# Altium project DC_Buck_Converter_5V.PrjPcb
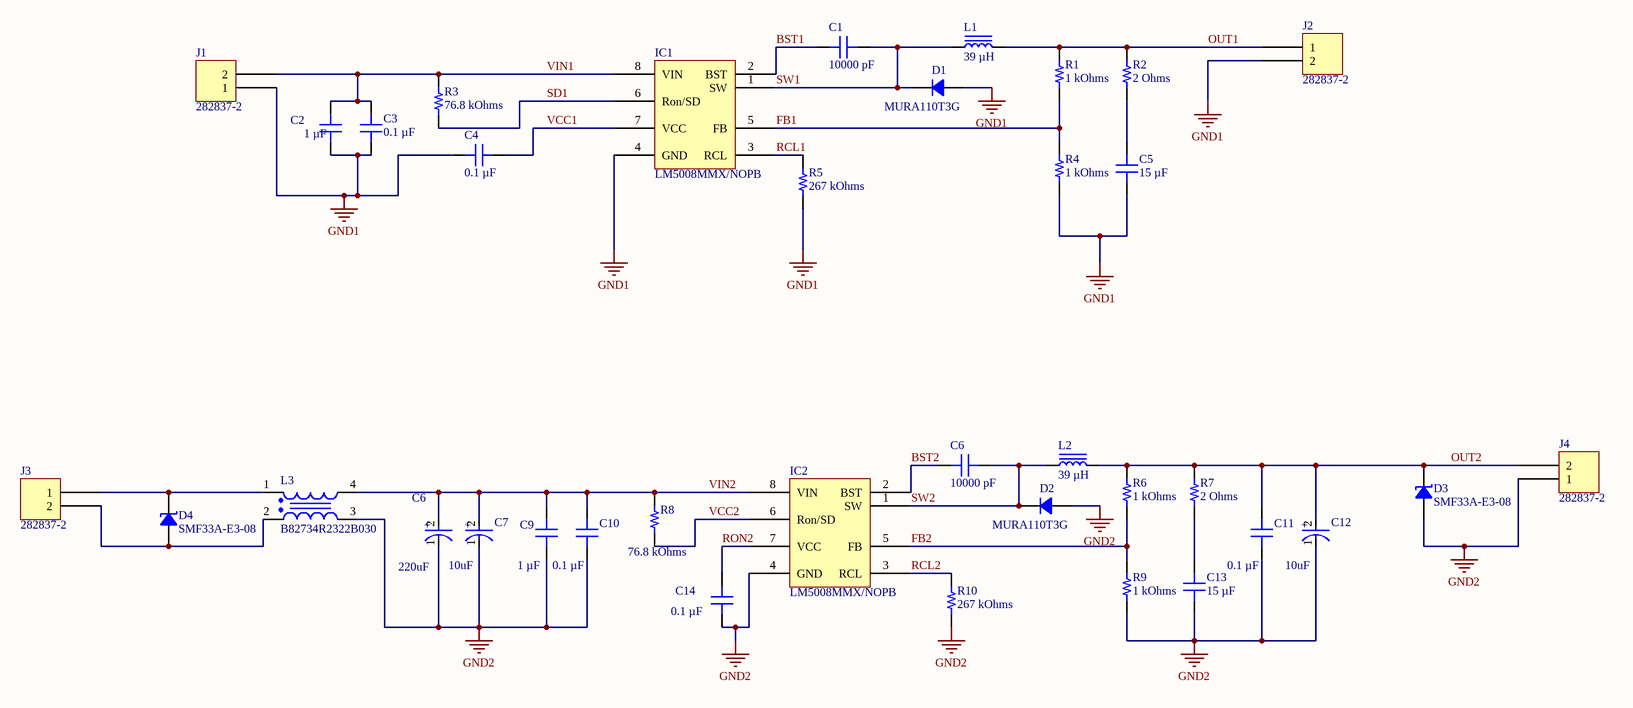
[diagram p0: Main.SchDoc]
1 sheet, 37 parts. Net scope: global (net labels, ports and power ports of the same name join across sheets).
Board file: DC_Buck_5V.PcbDoc

## Sheet Main.SchDoc
size A3; SheetNumber: 1; SheetTotal: 1

### Parts
(Parts that share a designator on the sheet are numbered #1, #2 ... from top to bottom, then left to right.)
C1  10000 pF  [CAP 0603_1608]
C2  1 µF  [CAP 0603_1608]
C3  0.1 µF  [CAP 0603_1608]
C4  0.1 µF  [CAP 0603_1608]
C5  15 µF  [CAP 0603_1608]
C6#1  10000 pF  [CAP 0603_1608]
C6#2  Capacitance: 220uF  [FP-FC-G-MFG]  (hidden comment: EEE-FC1H221P)
C7  Capacitance: 10uF  [FP-UUT1H100MCL1GS-MFG]  (hidden comment: UUT1H100MCL1GS)
C9  1 µF  [CAP 0603_1608]
C10  0.1 µF  [CAP 0603_1608]
C11  0.1 µF  [CAP 0603_1608]
C12  Capacitance: 10uF  [FP-UUT1H100MCL1GS-MFG]  (hidden comment: UUT1H100MCL1GS)
C13  15 µF  [CAP 0603_1608]
C14  0.1 µF  [CAP 0603_1608]
D1  MURA110T3G  [DO214AC SMA]
D2  MURA110T3G  [DO214AC SMA]
D3  SMF33A-E3-08  [SMF DO-219AB]
D4  SMF33A-E3-08  [SMF DO-219AB]
IC1  LM5008MMX/NOPB  [TI VSSOP-8 DGK]
IC2  LM5008MMX/NOPB  [TI VSSOP-8 DGK]
J1  282837-2  [TE 282837-2]
J2  282837-2  [TE 282837-2]
J3  282837-2  [TE 282837-2]
J4  282837-2  [TE 282837-2]
L1  39 µH  [BOURNS SRR1280]
L2  39 µH  [BOURNS SRR1280]
L3  Part Number: B82734R2322B030  [B82732R2112B30]  (hidden comment: Choke Alt)
R1  1 kOhms  [RES 0603_1608]
R2  2 Ohms  [RES 0603_1608]
R3  76.8 kOhms  [RES 0603_1608]
R4  1 kOhms  [RES 0603_1608]
R5  267 kOhms  [RES 0603_1608]
R6  1 kOhms  [RES 0603_1608]
R7  2 Ohms  [RES 0603_1608]
R8  76.8 kOhms  [RES 0603_1608]
R9  1 kOhms  [RES 0603_1608]
R10  267 kOhms  [RES 0603_1608]

### Nets
GND1: C2.1 C3.1 C4.2 C5.1 D1.1 IC1.4(GND) J1.1 J2.2 R4.1 R5.1
GND2: C6#2.1(C) C7.1(C) C9.1 C10.1 C11.1 C12.1(C) C13.1 C14.2 D2.1 D3.1 IC2.4(GND) J4.1 L3.3 R9.1 R10.1
BST1: C1.1 IC1.2(BST)
BST2: C6#1.1 IC2.2(BST)
FB1: IC1.5(FB) R1.1 R4.2
FB2: IC2.5(FB) R6.1 R9.2
OUT1: J2.1 L1.2 R1.2 R2.2
OUT2: C11.2 C12.2(A) D3.2 J4.2 L2.2 R6.2 R7.2
RCL1: IC1.3(RCL) R5.2
RCL2: IC2.3(RCL) R10.2
RON2: C14.1 IC2.7(VCC)
SD1: IC1.6(Ron/SD) R3.1
SW1: C1.2 D1.2 IC1.1(SW) L1.1
SW2: C6#1.2 D2.2 IC2.1(SW) L2.1
VCC1: C4.1 IC1.7(VCC)
VCC2: IC2.6(Ron/SD) R8.1
VIN1: C2.2 C3.2 IC1.8(VIN) J1.2 R3.2
VIN2: C6#2.2(A) C7.2(A) C9.2 C10.2 IC2.8(VIN) L3.4 R8.2
NetC5_2: C5.2 R2.1
NetC13_2: C13.2 R7.1
NetD4_1: D4.1 J3.2 L3.2
NetD4_2: D4.2 J3.1 L3.1

### Notes on the sheet
- TITLE:
- AUTHOR :
- DOCUMENT NAME:
- PART NO.:
- TEMPLATE:
- A3
- REVIEWER:
- This document is created by Mitai. Any further questions can be asked through
- Sheet
- of
- DATE:
- team@mitai.ai.
- Contact Address:Rosenheimer Straße 116b,81669, München.
- (in symbol CMP-05427-002161-1) +
- (in symbol CMP-12462-000014-1) +

### Library data of the parts
C1 C6#1 = AC0603KRX7R0BB103: CAP CER 10000PF 100V X7R 0603; manufacturer: Yageo; Tolerance: ±10%; Part Number: AC0603KRX7R0BB103; Value: 10000 pF; Applications: Automotive; Capacitance: 10000 pF; componentlink1description: Datasheet; componentlink1url: http://www.yageo.com/NewPortal/_en/search/productDocs.jsp?YageoPartNumber=AC0603KRX7R0BB103; componentlink2description: DigiKey Link; componentlink2url: https://www.digikey.com/en/products/detail/yageo/AC0603KRX7R0BB103/6643086; Device Package: 0603 (1608 Metric); lastupdated: 01/10/2023 19:09:12; Lifecycle Status: Active; Minimum Order: 1; Mounting Type: Surface Mount, MLCC; Operating Temperature: -55°C ~ 125°C; Package / Case: 0603 (1608 Metric); packaging: TapeAndReel; partid: 2218; Part Status: Active; price: 0.01; Ratings: AEC-Q200; series: AC; Size / Dimension: 0.063" L x 0.031" W (1.60mm x 0.80mm); Supplier 1: DigiKey; Supplier Part Number 1: 311-3100-1-ND; Temperature Coefficient: X7R; Thickness (Max): 0.035" (0.90mm); Voltage - Rated: 100V
C2 C9 = UMK107ABJ105MAHT: CAP CER 1UF 50V X5R 0603; manufacturer: Taiyo Yuden; Tolerance: ±20%; Part Number: UMK107ABJ105MAHT; Value: 1 µF; Applications: Automotive, SMPS Filtering; Capacitance: 1 µF; componentlink1description: Datasheet; componentlink1url: https://www.yuden.co.jp/productdata/catalog/mlcc_all_hq_e.pdf; componentlink2description: DigiKey Link; componentlink2url: https://www.digikey.com/en/products/detail/taiyo-yuden/UMK107ABJ105MAHT/6563551; Device Package: 0603 (1608 Metric); lastupdated: 01/10/2023 19:09:10; Lifecycle Status: Active; Minimum Order: 1; Mounting Type: Surface Mount, MLCC; Operating Temperature: -55°C ~ 85°C; Package / Case: 0603 (1608 Metric); packaging: TapeAndReel; partid: 3194; Part Status: Active; price: 0.03; Ratings: AEC-Q200; series: M; Size / Dimension: 0.063" L x 0.031" W (1.60mm x 0.80mm); Supplier 1: DigiKey; Supplier Part Number 1: 587-4958-1-ND; Temperature Coefficient: X5R; Thickness (Max): 0.037" (0.95mm); Voltage - Rated: 50V
C3 C4 C10 C11 C14 = C0603C104K5RAC7411: CAP CER 0.1UF 50V X7R 0603; manufacturer: KEMET; Tolerance: ±10%; Part Number: C0603C104K5RAC7411; Value: 0.1 µF; Applications: Bypass, Decoupling; Capacitance: 0.1 µF; componentlink1description: Datasheet; componentlink1url: https://api.kemet.com/component-edge/download/datasheet/C0603C104K5RAC7411.pdf; componentlink2description: DigiKey Link; componentlink2url: https://www.digikey.com/en/products/detail/kemet/C0603C104K5RAC7411/3317013; Device Package: 0603 (1608 Metric); lastupdated: 01/10/2023 19:09:12; Lifecycle Status: Active; Minimum Order: 1; Mounting Type: Surface Mount, MLCC; Operating Temperature: -55°C ~ 125°C; Package / Case: 0603 (1608 Metric); packaging: TapeAndReel; partid: 2233; Part Status: Active; price: 0.01; series: SMD Comm X7R; Size / Dimension: 0.063" L x 0.031" W (1.60mm x 0.80mm); Supplier 1: DigiKey; Supplier Part Number 1: 399-C0603C104K5RAC7411CT-ND; Temperature Coefficient: X7R; Thickness (Max): 0.035" (0.90mm); Voltage - Rated: 50V
C5 C13 = C1608X5R0J156M080AC: CAP CER 15UF 6.3V X5R 0603; manufacturer: TDK Corporation; Tolerance: ±20%; Part Number: C1608X5R0J156M080AC; Value: 15 µF; Applications: General Purpose; Capacitance: 15 µF; componentlink1description: Datasheet; componentlink1url: https://product.tdk.com/info/en/catalog/datasheets/mlcc_commercial_general_en.pdf?ref_disty=digikey; componentlink2description: DigiKey Link; componentlink2url: https://www.digikey.com/en/products/detail/tdk-corporation/C1608X5R0J156M080AC/2792253; Device Package: 0603 (1608 Metric); Features: Low ESL; lastupdated: 01/10/2023 19:09:11; Lifecycle Status: Active; Minimum Order: 1; Mounting Type: Surface Mount, MLCC; Operating Temperature: -55°C ~ 85°C; Package / Case: 0603 (1608 Metric); packaging: TapeAndReel; partid: 2610; Part Status: Active; price: 0.07; series: C; Size / Dimension: 0.063" L x 0.031" W (1.60mm x 0.80mm); Supplier 1: DigiKey; Supplier Part Number 1: 445-8027-1-ND; Temperature Coefficient: X5R; Thickness (Max): 0.039" (1.00mm); Voltage - Rated: 6.3V
C6#2 = CMP-05427-002161-1: CAP ALUM 220UF 20% 50V SMD; Life (Hours): 1000Hour; Leakage Current: 3uA; Ripple Current (AC): 500mA; Material: Aluminium; ESR (Equivalent Series Resistance): 300mR; Package Quantity: 500; Series: FC; Construction: Cylindrical; Length: 10.5mm; Height: 10.2mm; Width: 900um; Height - Seated (Max): 0.402inch; Lead Free: Lead Free; Voltage Rating: 50V; Contact Plating: Tin; RoHS Compliant: Yes; Packaging: Tape and Reel; Radiation Hardening: No; Reach SVHC Compliant: Yes; Voltage: 50V; Tolerance: 20%; Mount: Surface Mount; Ratings: AEC-Q200; Min Operating Temperature: -40°C; Ripple Current: 500mA; Diameter: 10mm; Termination: SMD/SMT; Case/Package: Radial; Max Operating Temperature: 105°C; Impedance: 300mR; Voltage Rating (DC): 50V
C7 C12 = CMP-12462-000014-1: CAP ALUM 10UF 20% 50V SMD; Lead Diameter: 0.8mm; Dissipation Factor: 0.12%; Ripple Current: 30mA; Dielectric Material: Aluminium; Leakage Current: 3uA; Life (Hours): 2000Hour; Height: 5.8mm; Lead Free: Lead Free; Mount: Surface Mount; Diameter: 6.3mm; Voltage Rating: 50V; Packaging: Tape and Reel; Case/Package: SMD/SMT; REACH SVHC: No SVHC; Height - Seated (Max): 0.24inch; Lead Pitch: 2.2mm; Voltage Rating (DC): 50V; Voltage: 50V; Radiation Hardening: No; Package Quantity: 1; Length: 5.8mm; Ripple Current (AC): 30mA; Number of Pins: 2; Width: 6.6mm; Features: General Purpose; Termination: SMD/SMT; Tolerance: 20%; Max Operating Temperature: 105°C; Min Operating Temperature: -55°C
D1 D2 = MURA110T3G: DIODE GEN PURP 100V 2A SMA; Manufacturer: ON Semiconductor; Current - Reverse Leakage @ Vr: 2µA @ 100V; Diode Type: Standard; Reverse Recovery Time (trr): 30ns; Speed: Fast Recovery =< 500ns, > 200mA (Io); Voltage - Forward (Vf) (Max) @ If: 875mV @ 1A; Part Number: MURA110T3G; ComponentLink1Description: Datasheet; ComponentLink1URL: //media.digikey.com/pdf/Data%20Sheets/ON%20Semiconductor%20PDFs/MURA105T3-D.pdf; ComponentLink2Description: DigiKey Link; ComponentLink2URL: http://digikey.com/product-detail/en/on-semiconductor/MURA110T3G/MURA110T3GOSCT-ND/964568; Current - Average Rectified (Io): 2A; LastUpdated: 01/10/2023 20:19:19; Lifecycle Status: Active; Minimum Order: 1; Mounting Type: Surface Mount; Operating Temperature - Junction: -65°C ~ 175°C; Package / Case: DO-214AC, SMA; Packaging: TapeAndReel; PartId: 641; Part Status: Active; Price: 0.10; Series: -; Supplier 1: DigiKey; Supplier Part Number 1: MURA110T3GOSCT-ND; Supplier Device Package: SMA; Voltage - DC Reverse (Vr) (Max): 100V
D3 D4 = SMF33A-E3-08: TVS DIODE 33V 53.3V SMF; Manufacturer: Vishay Semiconductor Diodes Division; Capacitance @ Frequency: 198pF @ 1MHz; Current - Peak Pulse (10/1000µs): 3.8A; Power Line Protection: No; Power - Peak Pulse: 200W; Type: Zener; Unidirectional Channels: 1; Voltage - Breakdown (Min): 36.7V; Part Number: SMF33A-E3-08; Applications: General Purpose; ComponentLink1Description: Datasheet; ComponentLink1URL: http://www.vishay.com/docs/85881/smf5v0atosmf58a.pdf; ComponentLink2Description: DigiKey Link; ComponentLink2URL: http://digikey.com/product-detail/en/vishay-semiconductor-diodes-division/SMF33A-E3-08/SMF33A-E3-08CT-ND/1680634; LastUpdated: 29/10/2023 20:46:48; Lifecycle Status: Active; Minimum Order: 1; Mounting Type: Surface Mount; Operating Temperature: -65°C ~ 175°C (TJ); Package / Case: DO-219AB; Packaging: TapeAndReel; PartId: 5501; Part Status: Active; Price: 0.10; Series: -; Supplier 1: DigiKey; Supplier Part Number 1: SMF33A-E3-08CT-ND; Supplier Device Package: SMF; Voltage - Clamping (Max) @ Ipp: 53.3V; Voltage - Reverse Standoff (Typ): 33V
IC1 IC2 = LM5008MMX/NOPB: IC REG BUCK ADJ 350MA 8VSSOP; Manufacturer: Texas Instruments; Frequency - Switching: 50kHz ~ 600kHz; Function: Step-Down; Number of Outputs: 1; Output Configuration: Positive; Output Type: Adjustable; Synchronous Rectifier: No; Voltage - Input (Max): 95V; Voltage - Input (Min): 9.5V; Voltage - Output (Max): 75V; Voltage - Output (Min/Fixed): 2.5V; Part Number: LM5008MMX/NOPB; ComponentLink1Description: Datasheet; ComponentLink1URL: http://www.ti.com/general/docs/suppproductinfo.tsp?distId=10&gotoUrl=http%3A%2F%2Fwww.ti.com%2Flit%2Fgpn%2Flm5008; ComponentLink2Description: DigiKey Link; ComponentLink2URL: //digikey.com/product-detail/en/texas-instruments/LM5008MMX-NOPB/296-35288-2-ND/1871803; Current - Output: 350mA; Device Package: 8-TSSOP, 8-MSOP (0.118", 3.00mm Width); LastUpdated: 12/12/2019 10:27:36; Lifecycle Status: 0; Minimum Order: 1; Mounting Type: Surface Mount; Operating Temperature: -40°C ~ 125°C (TJ); Package / Case: 8-TSSOP, 8-MSOP (0.118", 3.00mm Width); Packaging: TapeAndReel; Part Status: Active; Price: 1.30; Series: -; Supplier 1: DigiKey; Supplier Part Number 1: 296-35288-2-ND; Supplier Device Package: 8-VSSOP; Topology: Buck
J1-J4 = 282837-2: TERM BLK 2P SIDE ENT 5.08MM PCB; Manufacturer: TE Connectivity AMP Connectors; Current: 13.5 A; Mating Orientation: Horizontal with Board; Number of Levels: 1; Pitch: 0.200" (5.08mm); Positions Per Level: 2; Voltage: 300 V; Wire Gauge: 16-28 AWG; Wire Termination: Screw - Rising Cage Clamp; Part Number: 282837-2; Color: Green; ComponentLink1Description: Datasheet; ComponentLink1URL: https://www.te.com/commerce/DocumentDelivery/DDEController?Action=srchrtrv&DocNm=282837&DocType=Customer+Drawing&DocLang=English; ComponentLink2Description: DigiKey Link; ComponentLink2URL: https://www.digikey.com/en/products/detail/te-connectivity-amp-connectors/282837-2/2187973; Features: Interlocking (Side); LastUpdated: 21/06/2022 15:00:23; Lifecycle Status: Active; Minimum Order: 1; Mounting Type: Through Hole; Packaging: Tray; Part Status: Active; Price: 0.31; Series: Buchanan; Supplier 1: DigiKey; Supplier Part Number 1: A113320-ND
L1 L2 = SRR1280-390M: FIXED IND 39UH 3.2A 70 MOHM SMD; Manufacturer: Bourns Inc.; Current - Saturation: 3.1A; DC Resistance (DCR): 70mOhm Max; Frequency - Self Resonant: 8.5MHz; Inductance Frequency - Test: 100 kHz; Material - Core: Ferrite; Q @ Freq: 24 @ 2.52MHz; Shielding: Shielded; Tolerance: ±20%; Type: Drum Core, Wirewound; Part Number: SRR1280-390M; ComponentLink1Description: Datasheet; ComponentLink1URL: https://www.bourns.com/docs/Product-Datasheets/SRR1280.pdf; ComponentLink2Description: DigiKey Link; ComponentLink2URL: https://www.digikey.com/en/products/detail/bourns-inc/SRR1280-390M/1969999; Current Rating (Amps): 3.2 A; Device Package: Nonstandard; Height - Seated (Max): 0.315" (8.00mm); Inductance: 39 µH; LastUpdated: 01/10/2023 20:27:20; Lifecycle Status: Active; Minimum Order: 1; Mounting Type: Surface Mount; Operating Temperature: -40°C ~ 125°C; Package / Case: Nonstandard; Packaging: TapeAndReel; PartId: 15; Part Status: Active; Price: 0.51; Series: SRR1280; Size / Dimension: 0.492" L x 0.492" W (12.50mm x 12.50mm); Supplier 1: DigiKey; Supplier Part Number 1: 118-SRR1280-390MCT-ND; Value: 39 µH
L3 = B82734R2322B030: Manufacturer: TDK; Inductance: 6.8 mH; Rdc: 85m; Current: 3.2; Temp_ Max: 40; Temp_ Min: 0; Value: 6.8 mH 3.2 85mΩ; OrderingCode: B82734R2322B030; Supplier 1: Mouser; Supplier Part Number 1: 871-B82734R2322B30; Supplier 2: Farnell; Supplier Part Number 2: 1219129
R1 R4 R6 R9 = AT0603DRD071KL: RES SMD 1K OHM 0.5% 1/10W 0603; Manufacturer: Yageo; Power (Watts): 0.1W, 1/10W; Temperature Coefficient: ±25ppm/°C; Part Number: AT0603DRD071KL; Value: 1 kOhms; ComponentLink1Description: Datasheet; ComponentLink1URL: http://www.yageo.com/documents/recent/PYu-AT_51_RoHS_L_5.pdf; ComponentLink2Description: DigiKey Link; ComponentLink2URL: https://www.digikey.com/en/products/detail/yageo/AT0603DRD071KL/5138634; Composition: Thin Film; Device Package: 0603 (1608 Metric); Features: Anti-Sulfur, Automotive AEC-Q200, Moisture Resistant; Height - Seated (Max): 0.022" (0.55mm); LastUpdated: 01/10/2023 19:35:39; Lifecycle Status: Active; Minimum Order: 1; Number of Terminations: 2; Operating Temperature: -55°C ~ 155°C; Package / Case: 0603 (1608 Metric); Packaging: TapeAndReel; PartId: 4899; Part Status: Active; Price: 0.02; Ratings: AEC-Q200; Resistance: 1 kOhms; Series: AT; Size / Dimension: 0.063" L x 0.031" W (1.60mm x 0.80mm); Supplier 1: DigiKey; Supplier Part Number 1: YAG2115CT-ND; Supplier Device Package: 0603; Tolerance: ±0.5%
R2 R7 = SFR03EZPJ2R0: SULFUR TOLERANT CHIP RESISTORS; Manufacturer: Rohm Semiconductor; Power (Watts): 0.1W, 1/10W; Temperature Coefficient: ±400ppm/°C; Tolerance: ±5%; Part Number: SFR03EZPJ2R0; Value: 2 Ohms; ComponentLink1Description: Datasheet; ComponentLink1URL: https://fscdn.rohm.com/en/products/databook/datasheet/passive/resistor/chip_resistor/sfr-e.pdf; ComponentLink2Description: DigiKey Link; ComponentLink2URL: https://www.digikey.com/en/products/detail/rohm-semiconductor/SFR03EZPJ2R0/16179956; Composition: Thick Film; Device Package: 0603 (1608 Metric); Features: Anti-Sulfur, Automotive AEC-Q200; Height - Seated (Max): 0.022" (0.55mm); LastUpdated: 01/10/2023 19:33:15; Lifecycle Status: Active; Minimum Order: 1; Number of Terminations: 2; Operating Temperature: -55°C ~ 155°C; Package / Case: 0603 (1608 Metric); Packaging: TapeAndReel; PartId: 68512; Part Status: Active; Price: 0.01; Ratings: AEC-Q200; Resistance: 2 Ohms; Series: SFR; Size / Dimension: 0.063" L x 0.031" W (1.60mm x 0.80mm); Supplier 1: DigiKey; Supplier Part Number 1: 511-SFR03EZPJ2R0CT-ND; Supplier Device Package: 0603
R3 R8 = RG1608P-7682-B-T5: RES SMD 76.8KOHM 0.1% 1/10W 0603; Manufacturer: Susumu; Power (Watts): 0.1W, 1/10W; Temperature Coefficient: ±25ppm/°C; Part Number: RG1608P-7682-B-T5; Value: 76.8 kOhms; ComponentLink1Description: Datasheet; ComponentLink1URL: //media.digikey.com/pdf/Data%20Sheets/Susumu%20PDFs/RG_RM_RGH_Oct2012.pdf; ComponentLink2Description: DigiKey Link; ComponentLink2URL: https://www.digikey.com/en/products/detail/susumu/RG1608P-7682-B-T5/1240630; Composition: Thin Film; Device Package: 0603 (1608 Metric); Features: Anti-Sulfur, Automotive AEC-Q200; Height - Seated (Max): 0.020" (0.50mm); LastUpdated: 01/10/2023 19:35:32; Lifecycle Status: Active; Minimum Order: 1; Number of Terminations: 2; Operating Temperature: -55°C ~ 155°C; Package / Case: 0603 (1608 Metric); Packaging: TapeAndReel; PartId: 6774; Part Status: Active; Price: 0.05; Ratings: AEC-Q200; Resistance: 76.8 kOhms; Series: RG; Size / Dimension: 0.063" L x 0.031" W (1.60mm x 0.80mm); Supplier 1: DigiKey; Supplier Part Number 1: RG16P76.8KBCT-ND; Supplier Device Package: 0603; Tolerance: ±0.1%
R5 R10 = RT0603BRD07267KL: RES SMD 267K OHM 0.1% 1/10W 0603; Manufacturer: Yageo; Power (Watts): 0.1W, 1/10W; Temperature Coefficient: ±25ppm/°C; Part Number: RT0603BRD07267KL; Value: 267 kOhms; ComponentLink1Description: Datasheet; ComponentLink1URL: https://www.yageo.com/upload/media/product/productsearch/datasheet/rchip/PYu-RT_1-to-0.01_RoHS_L_11.pdf; ComponentLink2Description: DigiKey Link; ComponentLink2URL: https://www.digikey.com/en/products/detail/yageo/RT0603BRD07267KL/1072399; Composition: Thin Film; Device Package: 0603 (1608 Metric); Height - Seated (Max): 0.022" (0.55mm); LastUpdated: 01/10/2023 19:35:34; Lifecycle Status: Active; Minimum Order: 1; Number of Terminations: 2; Operating Temperature: -55°C ~ 155°C; Package / Case: 0603 (1608 Metric); Packaging: TapeAndReel; PartId: 6334; Part Status: Active; Price: 0.03; Resistance: 267 kOhms; Series: RT; Size / Dimension: 0.063" L x 0.031" W (1.60mm x 0.80mm); Supplier 1: DigiKey; Supplier Part Number 1: YAG4514CT-ND; Supplier Device Package: 0603; Tolerance: ±0.1%